# Altium schematic sheet BRD_XC95144XL.SchDoc
size A2
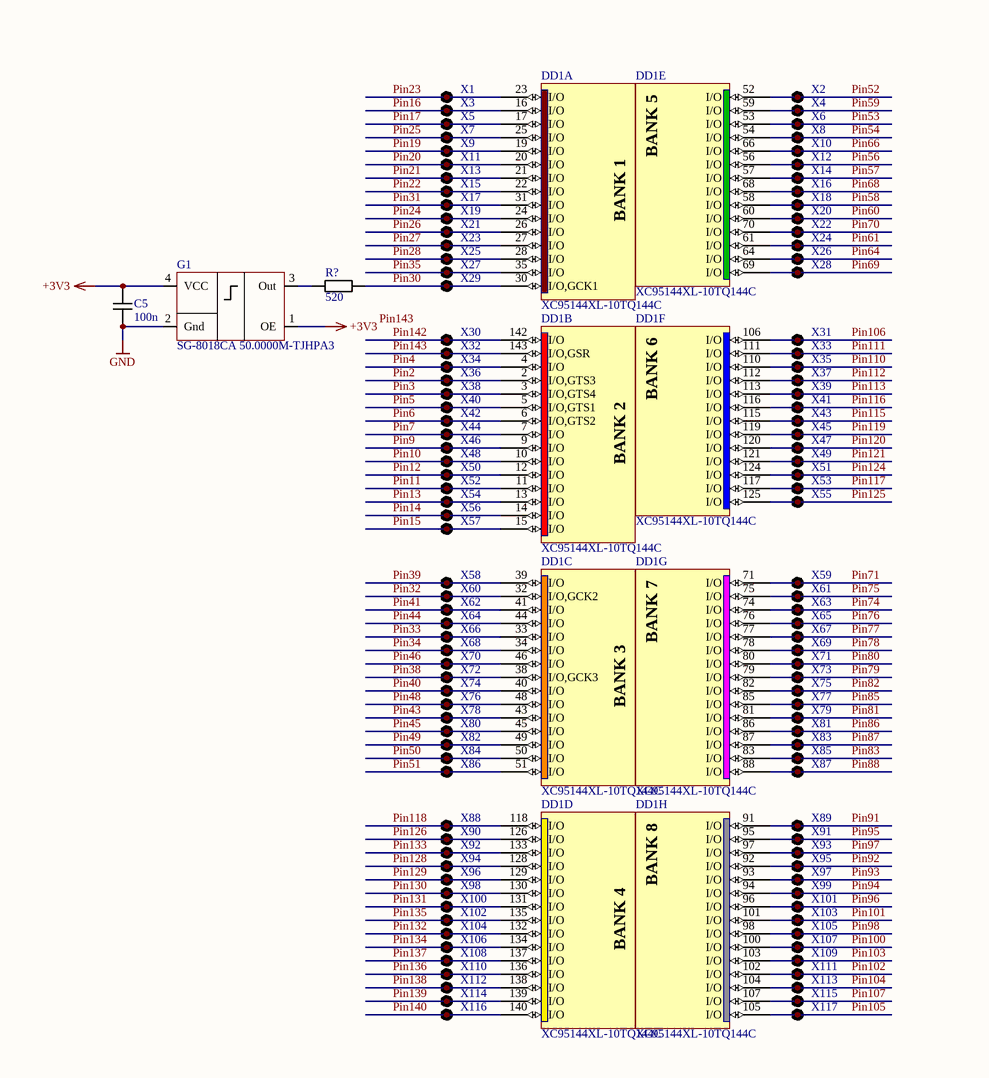
[diagram p0: BRD_XC95144XL.SchDoc, top left]
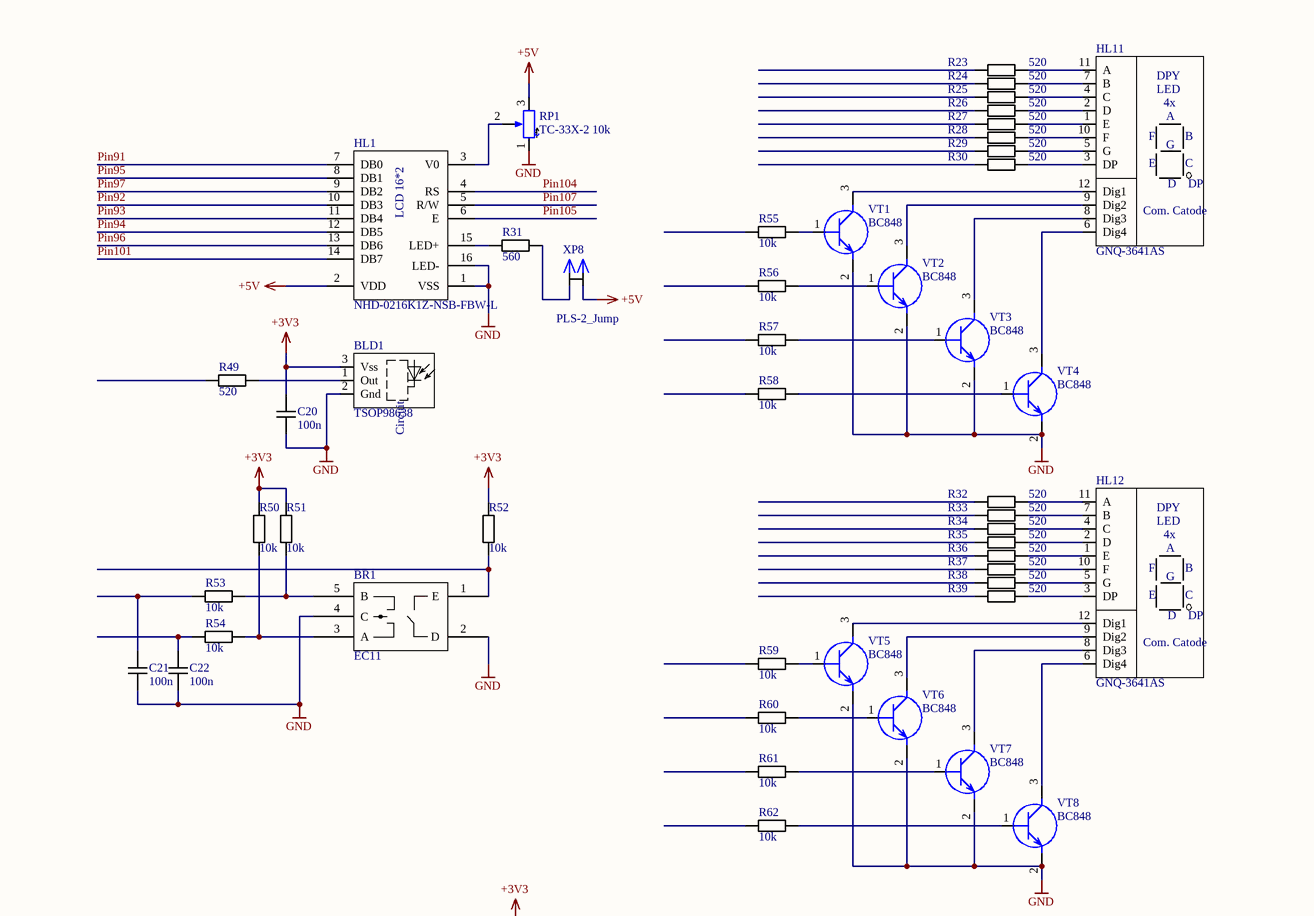
[diagram p1: BRD_XC95144XL.SchDoc, top right]
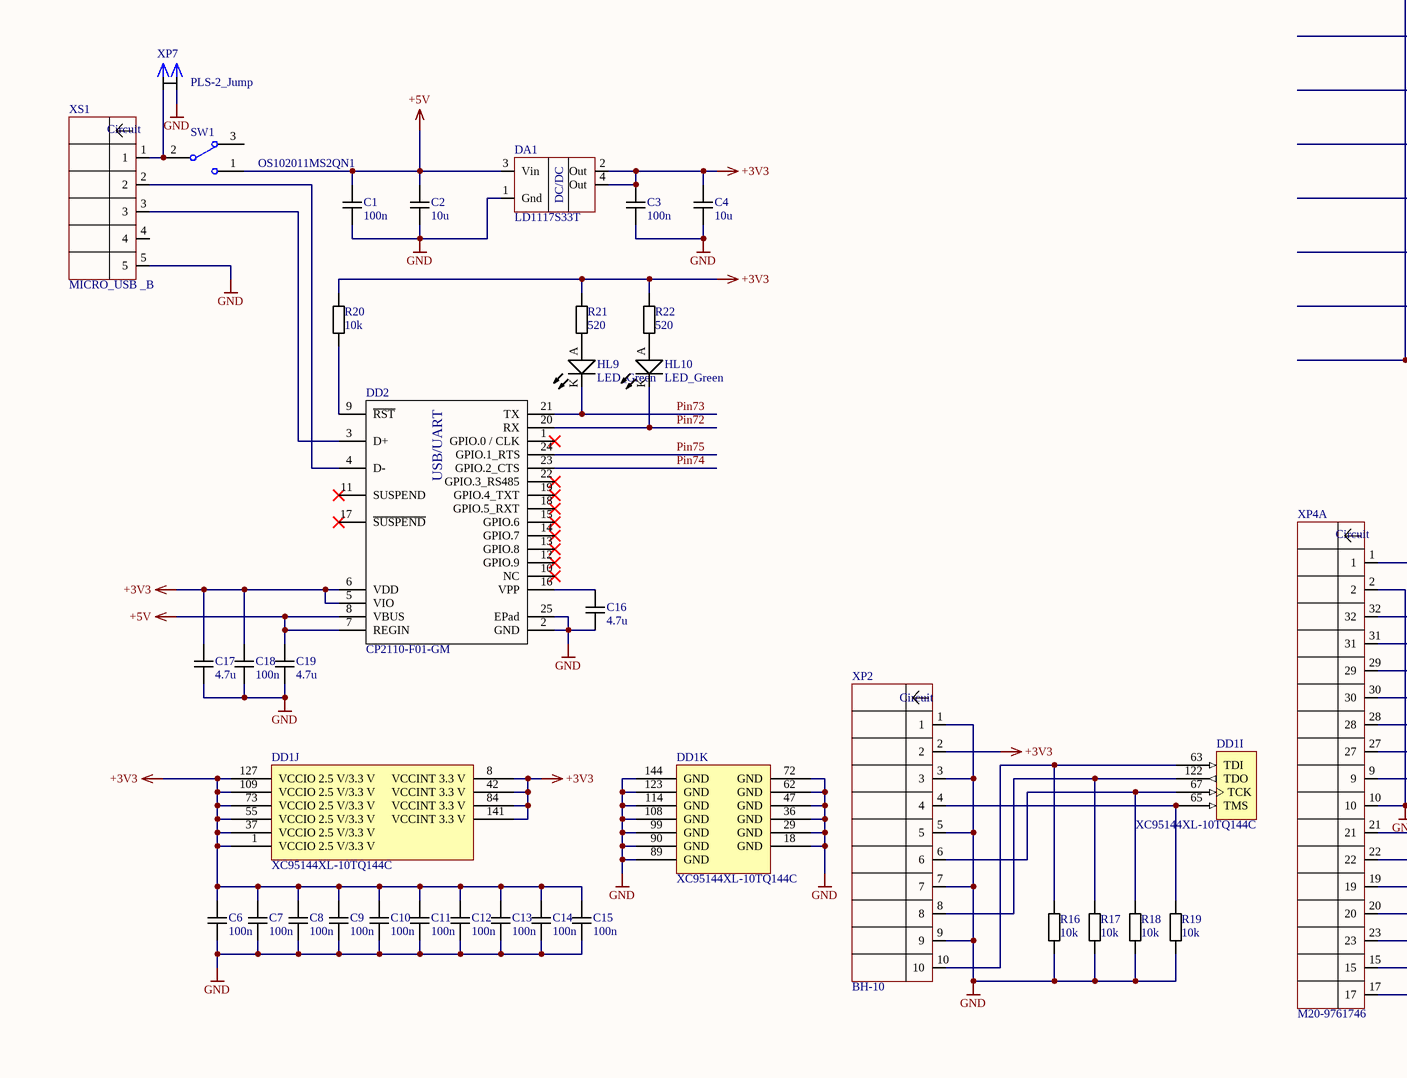
[diagram p2: BRD_XC95144XL.SchDoc, bottom left]
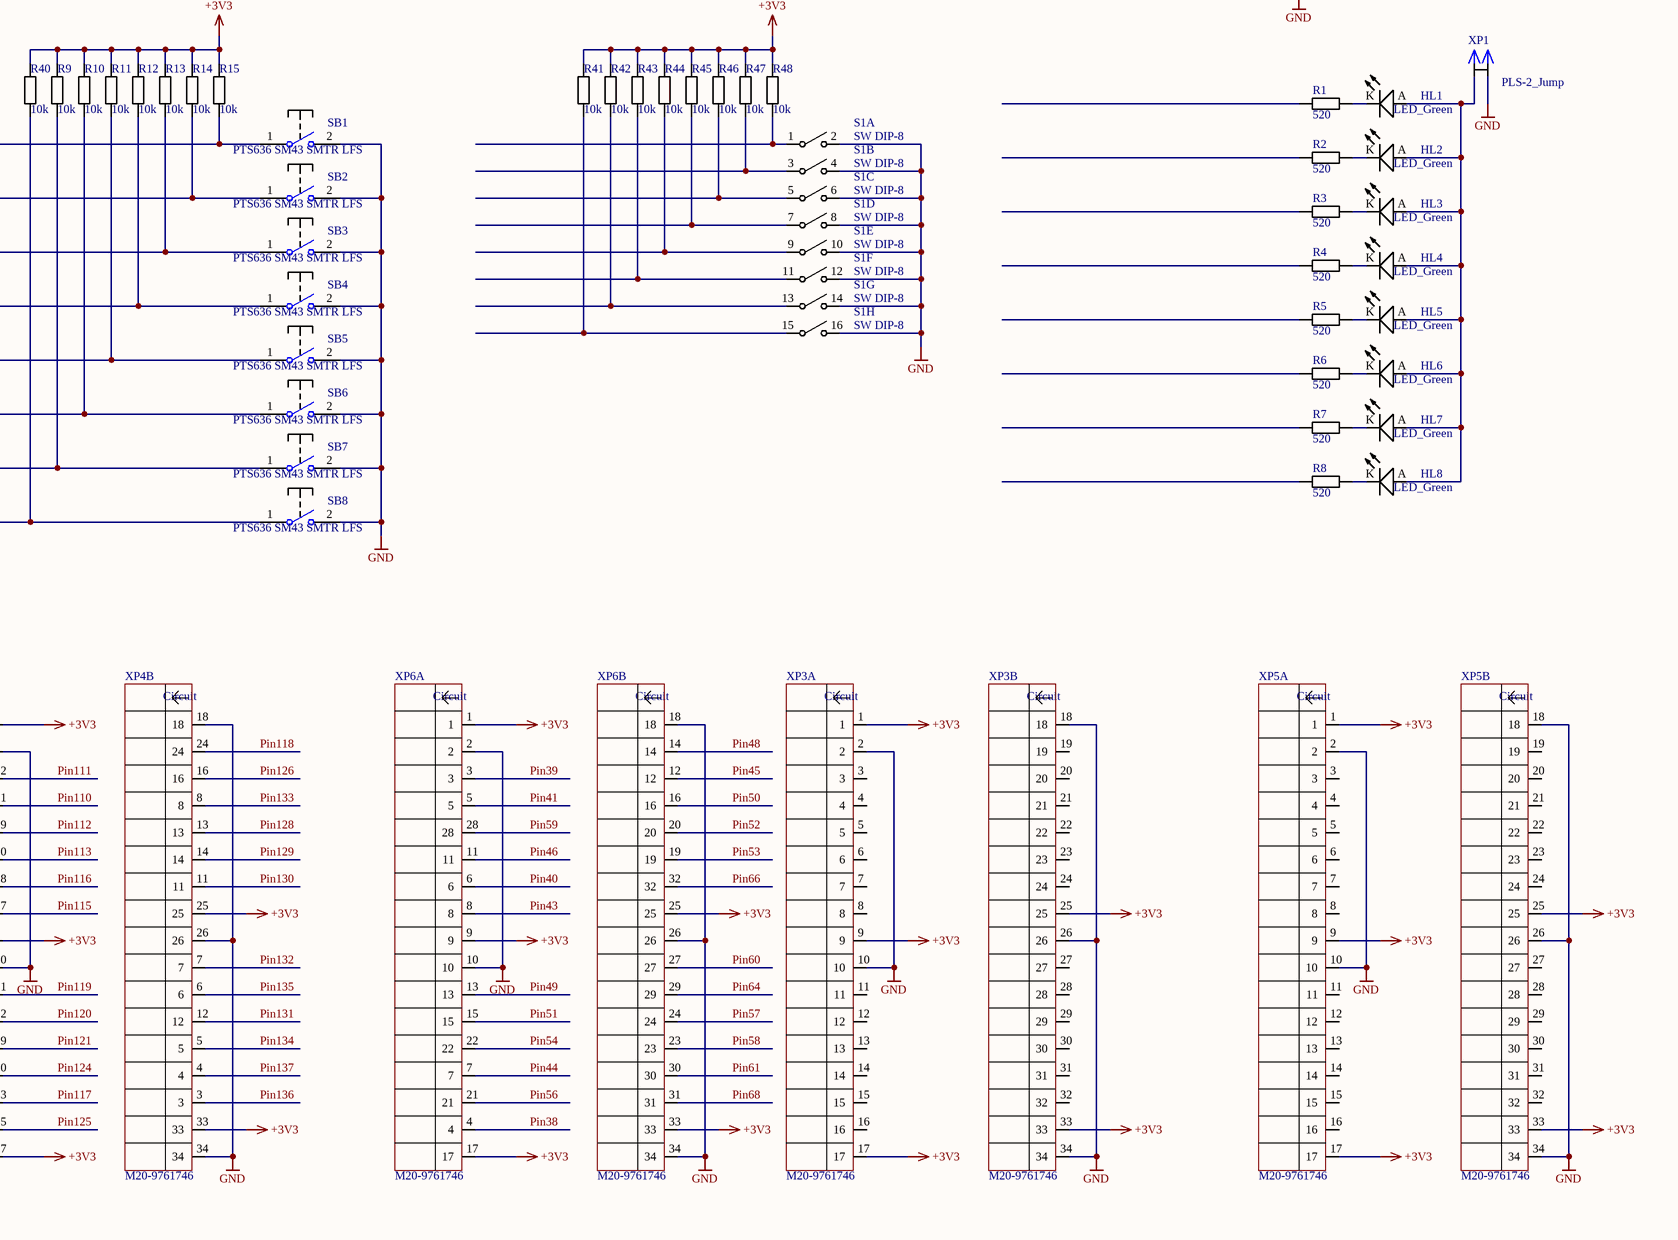
[diagram p3: BRD_XC95144XL.SchDoc, bottom right]

## Parts
(Parts that share a designator on the sheet are numbered #1, #2 ... from top to bottom, then left to right.)
BLD1  TSOP98638  [TSOP98638]
BR1  EC11  [EC11]
C1  100n  [CAPC1608(0603)N]
C2  10u  [CAPC1608(0603)N]
C3  100n  [CAPC1608(0603)N]
C4  10u  [CAPC1608(0603)N]
C5  100n  [CAPC1608(0603)N]
C6  100n  [CAPC1608(0603)N]
C7  100n  [CAPC1608(0603)N]
C8  100n  [CAPC1608(0603)N]
C9  100n  [CAPC1608(0603)N]
C10  100n  [CAPC1608(0603)N]
C11  100n  [CAPC1608(0603)N]
C12  100n  [CAPC1608(0603)N]
C13  100n  [CAPC1608(0603)N]
C14  100n  [CAPC1608(0603)N]
C15  100n  [CAPC1608(0603)N]
C16  4.7u  [CAPC1608(0603)N]
C17  4.7u  [CAPC1608(0603)N]
C18  100n  [CAPC1608(0603)N]
C19  4.7u  [CAPC1608(0603)N]
C20  100n  [CAPC1608(0603)N]
C21  100n  [CAPC1608(0603)N]
C22  100n  [CAPC1608(0603)N]
DA1  LD1117S33T  [SOT223_M]
DD1  XC95144XL-10TQ144C  [TQ144_M]  (parts A,B,C,D,E,F,G,H,I,J,K of 11)
DD2  CP2110-F01-GM  [QFN24_L]
G1  SG-8018CA 50.0000M-TJHPA3  [SG-8018CA]
HL1#1  NHD-0216K1Z-NSB-FBW-L  [NHD-0216K1Z-NSB-FBW-L]
HL1#2  LED_Green  [LED-0603-GREEN]
HL2  LED_Green  [LED-0603-GREEN]
HL3  LED_Green  [LED-0603-GREEN]
HL4  LED_Green  [LED-0603-GREEN]
HL5  LED_Green  [LED-0603-GREEN]
HL6  LED_Green  [LED-0603-GREEN]
HL7  LED_Green  [LED-0603-GREEN]
HL8  LED_Green  [LED-0603-GREEN]
HL9  LED_Green  [LED-0603-GREEN]
HL10  LED_Green  [LED-0603-GREEN]
HL11  GNQ-3641AS  [GNQ-3641AS]
HL12  GNQ-3641AS  [GNQ-3641AS]
R1  520  [RESC1608(0603)N]
R2  520  [RESC1608(0603)N]
R3  520  [RESC1608(0603)N]
R4  520  [RESC1608(0603)N]
R5  520  [RESC1608(0603)N]
R6  520  [RESC1608(0603)N]
R7  520  [RESC1608(0603)N]
R8  520  [RESC1608(0603)N]
R9  10k  [RESC1608(0603)N]
R10  10k  [RESC1608(0603)N]
R11  10k  [RESC1608(0603)N]
R12  10k  [RESC1608(0603)N]
R13  10k  [RESC1608(0603)N]
R14  10k  [RESC1608(0603)N]
R15  10k  [RESC1608(0603)N]
R16  10k  [RESC1608(0603)N]
R17  10k  [RESC1608(0603)N]
R18  10k  [RESC1608(0603)N]
R19  10k  [RESC1608(0603)N]
R20  10k  [RESC1608(0603)N]
R21  520  [RESC1608(0603)N]
R22  520  [RESC1608(0603)N]
R23  520  [RESC1608(0603)N]
R24  520  [RESC1608(0603)N]
R25  520  [RESC1608(0603)N]
R26  520  [RESC1608(0603)N]
R27  520  [RESC1608(0603)N]
R28  520  [RESC1608(0603)N]
R29  520  [RESC1608(0603)N]
R30  520  [RESC1608(0603)N]
R31  560  [RESC1608(0603)N]
R32  520  [RESC1608(0603)N]
R33  520  [RESC1608(0603)N]
R34  520  [RESC1608(0603)N]
R35  520  [RESC1608(0603)N]
R36  520  [RESC1608(0603)N]
R37  520  [RESC1608(0603)N]
R38  520  [RESC1608(0603)N]
R39  520  [RESC1608(0603)N]
R40  10k  [RESC1608(0603)N]
R41  10k  [RESC1608(0603)N]
R42  10k  [RESC1608(0603)N]
R43  10k  [RESC1608(0603)N]
R44  10k  [RESC1608(0603)N]
R45  10k  [RESC1608(0603)N]
R46  10k  [RESC1608(0603)N]
R47  10k  [RESC1608(0603)N]
R48  10k  [RESC1608(0603)N]
R49  520  [RESC1608(0603)N]
R50  10k  [RESC1608(0603)N]
R51  10k  [RESC1608(0603)N]
R52  10k  [RESC1608(0603)N]
R53  10k  [RESC1608(0603)N]
R54  10k  [RESC1608(0603)N]
R55  10k  [RESC1608(0603)N]
R56  10k  [RESC1608(0603)N]
R57  10k  [RESC1608(0603)N]
R58  10k  [RESC1608(0603)N]
R59  10k  [RESC1608(0603)N]
R60  10k  [RESC1608(0603)N]
R61  10k  [RESC1608(0603)N]
R62  10k  [RESC1608(0603)N]
R?  520  [RESC1608(0603)N]
RP1  TC-33X-2 10k  [TC-33X-2]
S1  SW DIP-8  [DS01C-254-S-08BE]  (parts A,B,C,D,E,F,G,H of 8)
SB1  PTS636 SM43 SMTR LFS  [PTS636 SM43 SMTR LFS]
SB2  PTS636 SM43 SMTR LFS  [PTS636 SM43 SMTR LFS]
SB3  PTS636 SM43 SMTR LFS  [PTS636 SM43 SMTR LFS]
SB4  PTS636 SM43 SMTR LFS  [PTS636 SM43 SMTR LFS]
SB5  PTS636 SM43 SMTR LFS  [PTS636 SM43 SMTR LFS]
SB6  PTS636 SM43 SMTR LFS  [PTS636 SM43 SMTR LFS]
SB7  PTS636 SM43 SMTR LFS  [PTS636 SM43 SMTR LFS]
SB8  PTS636 SM43 SMTR LFS  [PTS636 SM43 SMTR LFS]
SW1  OS102011MS2QN1  [OS102011MS2QN1]
VT1  BC848  [SOT23-3N]
VT2  BC848  [SOT23-3N]
VT3  BC848  [SOT23-3N]
VT4  BC848  [SOT23-3N]
VT5  BC848  [SOT23-3N]
VT6  BC848  [SOT23-3N]
VT7  BC848  [SOT23-3N]
VT8  BC848  [SOT23-3N]
X1  X1-1.27-1-TOP-RR  [1.27-1-TOP-RR]  (value not drawn)
X2  X1-1.27-1-TOP-RR  [1.27-1-TOP-RR]  (value not drawn)
X3  X1-1.27-1-TOP-RR  [1.27-1-TOP-RR]  (value not drawn)
X4  X1-1.27-1-TOP-RR  [1.27-1-TOP-RR]  (value not drawn)
X5  X1-1.27-1-TOP-RR  [1.27-1-TOP-RR]  (value not drawn)
X6  X1-1.27-1-TOP-RR  [1.27-1-TOP-RR]  (value not drawn)
X7  X1-1.27-1-TOP-RR  [1.27-1-TOP-RR]  (value not drawn)
X8  X1-1.27-1-TOP-RR  [1.27-1-TOP-RR]  (value not drawn)
X9  X1-1.27-1-TOP-RR  [1.27-1-TOP-RR]  (value not drawn)
X10  X1-1.27-1-TOP-RR  [1.27-1-TOP-RR]  (value not drawn)
X11  X1-1.27-1-TOP-RR  [1.27-1-TOP-RR]  (value not drawn)
X12  X1-1.27-1-TOP-RR  [1.27-1-TOP-RR]  (value not drawn)
X13  X1-1.27-1-TOP-RR  [1.27-1-TOP-RR]  (value not drawn)
X14  X1-1.27-1-TOP-RR  [1.27-1-TOP-RR]  (value not drawn)
X15  X1-1.27-1-TOP-RR  [1.27-1-TOP-RR]  (value not drawn)
X16  X1-1.27-1-TOP-RR  [1.27-1-TOP-RR]  (value not drawn)
X17  X1-1.27-1-TOP-RR  [1.27-1-TOP-RR]  (value not drawn)
X18  X1-1.27-1-TOP-RR  [1.27-1-TOP-RR]  (value not drawn)
X19  X1-1.27-1-TOP-RR  [1.27-1-TOP-RR]  (value not drawn)
X20  X1-1.27-1-TOP-RR  [1.27-1-TOP-RR]  (value not drawn)
X21  X1-1.27-1-TOP-RR  [1.27-1-TOP-RR]  (value not drawn)
X22  X1-1.27-1-TOP-RR  [1.27-1-TOP-RR]  (value not drawn)
X23  X1-1.27-1-TOP-RR  [1.27-1-TOP-RR]  (value not drawn)
X24  X1-1.27-1-TOP-RR  [1.27-1-TOP-RR]  (value not drawn)
X25  X1-1.27-1-TOP-RR  [1.27-1-TOP-RR]  (value not drawn)
X26  X1-1.27-1-TOP-RR  [1.27-1-TOP-RR]  (value not drawn)
X27  X1-1.27-1-TOP-RR  [1.27-1-TOP-RR]  (value not drawn)
X28  X1-1.27-1-TOP-RR  [1.27-1-TOP-RR]  (value not drawn)
X29  X1-1.27-1-TOP-RR  [1.27-1-TOP-RR]  (value not drawn)
X30  X1-1.27-1-TOP-RR  [1.27-1-TOP-RR]  (value not drawn)
X31  X1-1.27-1-TOP-RR  [1.27-1-TOP-RR]  (value not drawn)
X32  X1-1.27-1-TOP-RR  [1.27-1-TOP-RR]  (value not drawn)
X33  X1-1.27-1-TOP-RR  [1.27-1-TOP-RR]  (value not drawn)
X34  X1-1.27-1-TOP-RR  [1.27-1-TOP-RR]  (value not drawn)
X35  X1-1.27-1-TOP-RR  [1.27-1-TOP-RR]  (value not drawn)
X36  X1-1.27-1-TOP-RR  [1.27-1-TOP-RR]  (value not drawn)
X37  X1-1.27-1-TOP-RR  [1.27-1-TOP-RR]  (value not drawn)
X38  X1-1.27-1-TOP-RR  [1.27-1-TOP-RR]  (value not drawn)
X39  X1-1.27-1-TOP-RR  [1.27-1-TOP-RR]  (value not drawn)
X40  X1-1.27-1-TOP-RR  [1.27-1-TOP-RR]  (value not drawn)
X41  X1-1.27-1-TOP-RR  [1.27-1-TOP-RR]  (value not drawn)
X42  X1-1.27-1-TOP-RR  [1.27-1-TOP-RR]  (value not drawn)
X43  X1-1.27-1-TOP-RR  [1.27-1-TOP-RR]  (value not drawn)
X44  X1-1.27-1-TOP-RR  [1.27-1-TOP-RR]  (value not drawn)
X45  X1-1.27-1-TOP-RR  [1.27-1-TOP-RR]  (value not drawn)
X46  X1-1.27-1-TOP-RR  [1.27-1-TOP-RR]  (value not drawn)
X47  X1-1.27-1-TOP-RR  [1.27-1-TOP-RR]  (value not drawn)
X48  X1-1.27-1-TOP-RR  [1.27-1-TOP-RR]  (value not drawn)
X49  X1-1.27-1-TOP-RR  [1.27-1-TOP-RR]  (value not drawn)
X50  X1-1.27-1-TOP-RR  [1.27-1-TOP-RR]  (value not drawn)
X51  X1-1.27-1-TOP-RR  [1.27-1-TOP-RR]  (value not drawn)
X52  X1-1.27-1-TOP-RR  [1.27-1-TOP-RR]  (value not drawn)
X53  X1-1.27-1-TOP-RR  [1.27-1-TOP-RR]  (value not drawn)
X54  X1-1.27-1-TOP-RR  [1.27-1-TOP-RR]  (value not drawn)
X55  X1-1.27-1-TOP-RR  [1.27-1-TOP-RR]  (value not drawn)
X56  X1-1.27-1-TOP-RR  [1.27-1-TOP-RR]  (value not drawn)
X57  X1-1.27-1-TOP-RR  [1.27-1-TOP-RR]  (value not drawn)
X58  X1-1.27-1-TOP-RR  [1.27-1-TOP-RR]  (value not drawn)
X59  X1-1.27-1-TOP-RR  [1.27-1-TOP-RR]  (value not drawn)
X60  X1-1.27-1-TOP-RR  [1.27-1-TOP-RR]  (value not drawn)
X61  X1-1.27-1-TOP-RR  [1.27-1-TOP-RR]  (value not drawn)
X62  X1-1.27-1-TOP-RR  [1.27-1-TOP-RR]  (value not drawn)
X63  X1-1.27-1-TOP-RR  [1.27-1-TOP-RR]  (value not drawn)
X64  X1-1.27-1-TOP-RR  [1.27-1-TOP-RR]  (value not drawn)
X65  X1-1.27-1-TOP-RR  [1.27-1-TOP-RR]  (value not drawn)
X66  X1-1.27-1-TOP-RR  [1.27-1-TOP-RR]  (value not drawn)
X67  X1-1.27-1-TOP-RR  [1.27-1-TOP-RR]  (value not drawn)
X68  X1-1.27-1-TOP-RR  [1.27-1-TOP-RR]  (value not drawn)
X69  X1-1.27-1-TOP-RR  [1.27-1-TOP-RR]  (value not drawn)
X70  X1-1.27-1-TOP-RR  [1.27-1-TOP-RR]  (value not drawn)
X71  X1-1.27-1-TOP-RR  [1.27-1-TOP-RR]  (value not drawn)
X72  X1-1.27-1-TOP-RR  [1.27-1-TOP-RR]  (value not drawn)
X73  X1-1.27-1-TOP-RR  [1.27-1-TOP-RR]  (value not drawn)
X74  X1-1.27-1-TOP-RR  [1.27-1-TOP-RR]  (value not drawn)
X75  X1-1.27-1-TOP-RR  [1.27-1-TOP-RR]  (value not drawn)
X76  X1-1.27-1-TOP-RR  [1.27-1-TOP-RR]  (value not drawn)
X77  X1-1.27-1-TOP-RR  [1.27-1-TOP-RR]  (value not drawn)
X78  X1-1.27-1-TOP-RR  [1.27-1-TOP-RR]  (value not drawn)
X79  X1-1.27-1-TOP-RR  [1.27-1-TOP-RR]  (value not drawn)
X80  X1-1.27-1-TOP-RR  [1.27-1-TOP-RR]  (value not drawn)
X81  X1-1.27-1-TOP-RR  [1.27-1-TOP-RR]  (value not drawn)
X82  X1-1.27-1-TOP-RR  [1.27-1-TOP-RR]  (value not drawn)
X83  X1-1.27-1-TOP-RR  [1.27-1-TOP-RR]  (value not drawn)
X84  X1-1.27-1-TOP-RR  [1.27-1-TOP-RR]  (value not drawn)
X85  X1-1.27-1-TOP-RR  [1.27-1-TOP-RR]  (value not drawn)
X86  X1-1.27-1-TOP-RR  [1.27-1-TOP-RR]  (value not drawn)
X87  X1-1.27-1-TOP-RR  [1.27-1-TOP-RR]  (value not drawn)
X88  X1-1.27-1-TOP-RR  [1.27-1-TOP-RR]  (value not drawn)
X89  X1-1.27-1-TOP-RR  [1.27-1-TOP-RR]  (value not drawn)
X90  X1-1.27-1-TOP-RR  [1.27-1-TOP-RR]  (value not drawn)
X91  X1-1.27-1-TOP-RR  [1.27-1-TOP-RR]  (value not drawn)
X92  X1-1.27-1-TOP-RR  [1.27-1-TOP-RR]  (value not drawn)
X93  X1-1.27-1-TOP-RR  [1.27-1-TOP-RR]  (value not drawn)
X94  X1-1.27-1-TOP-RR  [1.27-1-TOP-RR]  (value not drawn)
X95  X1-1.27-1-TOP-RR  [1.27-1-TOP-RR]  (value not drawn)
X96  X1-1.27-1-TOP-RR  [1.27-1-TOP-RR]  (value not drawn)
X97  X1-1.27-1-TOP-RR  [1.27-1-TOP-RR]  (value not drawn)
X98  X1-1.27-1-TOP-RR  [1.27-1-TOP-RR]  (value not drawn)
X99  X1-1.27-1-TOP-RR  [1.27-1-TOP-RR]  (value not drawn)
X100  X1-1.27-1-TOP-RR  [1.27-1-TOP-RR]  (value not drawn)
X101  X1-1.27-1-TOP-RR  [1.27-1-TOP-RR]  (value not drawn)
X102  X1-1.27-1-TOP-RR  [1.27-1-TOP-RR]  (value not drawn)
X103  X1-1.27-1-TOP-RR  [1.27-1-TOP-RR]  (value not drawn)
X104  X1-1.27-1-TOP-RR  [1.27-1-TOP-RR]  (value not drawn)
X105  X1-1.27-1-TOP-RR  [1.27-1-TOP-RR]  (value not drawn)
X106  X1-1.27-1-TOP-RR  [1.27-1-TOP-RR]  (value not drawn)
X107  X1-1.27-1-TOP-RR  [1.27-1-TOP-RR]  (value not drawn)
X108  X1-1.27-1-TOP-RR  [1.27-1-TOP-RR]  (value not drawn)
X109  X1-1.27-1-TOP-RR  [1.27-1-TOP-RR]  (value not drawn)
X110  X1-1.27-1-TOP-RR  [1.27-1-TOP-RR]  (value not drawn)
X111  X1-1.27-1-TOP-RR  [1.27-1-TOP-RR]  (value not drawn)
X112  X1-1.27-1-TOP-RR  [1.27-1-TOP-RR]  (value not drawn)
X113  X1-1.27-1-TOP-RR  [1.27-1-TOP-RR]  (value not drawn)
X114  X1-1.27-1-TOP-RR  [1.27-1-TOP-RR]  (value not drawn)
X115  X1-1.27-1-TOP-RR  [1.27-1-TOP-RR]  (value not drawn)
X116  X1-1.27-1-TOP-RR  [1.27-1-TOP-RR]  (value not drawn)
X117  X1-1.27-1-TOP-RR  [1.27-1-TOP-RR]  (value not drawn)
XP1  PLS-2_Jump  [PLS-2-3D]
XP2  BH-10  [BH-10]
XP3  M20-9761746  [PLD-34-3D]  (parts A,B of 2)
XP4  M20-9761746  [PLD-34-3D]  (parts A,B of 2)
XP5  M20-9761746  [PLD-34-3D]  (parts A,B of 2)
XP6  M20-9761746  [PLD-34-3D]  (parts A,B of 2)
XP7  PLS-2_Jump  [PLS-2-3D]
XP8  PLS-2_Jump  [PLS-2-3D]
XS1  MICRO_USB _B  [MICRO_USB _B]

## Nets
+3V3: BLD1.3(Vss) C3.2 C4.2 C5.2 C6.2 C7.2 C8.2 C9.2 C10.2 C11.2 C12.2 C13.2 C14.2 C15.2 C17.2 C18.2 C20.2 DA1.2(Out) DA1.4(Out) DD1.1(VCCIO_2.5_V/3.3_V) DD1.8(VCCINT_3.3_V) DD1.37(VCCIO_2.5_V/3.3_V) DD1.42(VCCINT_3.3_V) DD1.55(VCCIO_2.5_V/3.3_V) DD1.73(VCCIO_2.5_V/3.3_V) DD1.84(VCCINT_3.3_V) DD1.109(VCCIO_2.5_V/3.3_V) DD1.127(VCCIO_2.5_V/3.3_V) DD1.141(VCCINT_3.3_V) DD2.5(VIO) DD2.6(VDD) G1.1(OE) G1.4(VCC) R9.1 R10.1 R11.1 R12.1 R13.1 R14.1 R15.1 R20.2 R21.2 R22.2 R40.1 R41.1 R42.1 R43.1 R44.1 R45.1 R46.1 R47.1 R48.1 R50.1 R51.1 R52.1 XP2.2 XP3.1 XP3.9 XP3.17 XP3.25 XP3.33 XP4.1 XP4.9 XP4.17 XP4.25 XP4.33 XP5.1 XP5.9 XP5.17 XP5.25 XP5.33 XP6.1 XP6.9 XP6.17 XP6.25 XP6.33
+5V: C1.2 C2.2 C19.2 DA1.3(Vin) DD2.7(REGIN) DD2.8(VBUS) HL1#1.2(VDD) RP1.3(TAP) SW1.1 XP8.2
GND: BLD1.2(Gnd) BR1.2(D) BR1.4(C) C1.1 C2.1 C3.1 C4.1 C5.1 C6.1 C7.1 C8.1 C9.1 C10.1 C11.1 C12.1 C13.1 C14.1 C15.1 C16.1 C17.1 C18.1 C19.1 C20.1 C21.1 C22.1 DA1.1(Gnd) DD1.18(GND) DD1.29(GND) DD1.36(GND) DD1.47(GND) DD1.62(GND) DD1.72(GND) DD1.89(GND) DD1.90(GND) DD1.99(GND) DD1.108(GND) DD1.114(GND) DD1.123(GND) DD1.144(GND) DD2.2(GND) DD2.25(EPad) G1.2(Gnd) HL1#1.1(VSS) HL1#1.16(LED-) R16.1 R17.1 R18.1 R19.1 RP1.1(TOP) S1.2 S1.4 S1.6 S1.8 S1.10 S1.12 S1.14 S1.16 SB1.2(NO) SB2.2(NO) SB3.2(NO) SB4.2(NO) SB5.2(NO) SB6.2(NO) SB7.2(NO) SB8.2(NO) VT1.2(E) VT2.2(E) VT3.2(E) VT4.2(E) VT5.2(E) VT6.2(E) VT7.2(E) VT8.2(E) XP1.2 XP2.1 XP2.3 XP2.5 XP2.7 XP2.9 XP3.2 XP3.10 XP3.18 XP3.26 XP3.34 XP4.2 XP4.10 XP4.18 XP4.26 XP4.34 XP5.2 XP5.10 XP5.18 XP5.26 XP5.34 XP6.2 XP6.10 XP6.18 XP6.26 XP6.34 XP7.2 XS1.5
Pin2: DD1.2(I/O,GTS3) X36.1
Pin3: DD1.3(I/O,GTS4) X38.1
Pin4: DD1.4(I/O) X34.1
Pin5: DD1.5(I/O,GTS1) X40.1
Pin6: DD1.6(I/O,GTS2) X42.1
Pin7: DD1.7(I/O) X44.1
Pin9: DD1.9(I/O) X46.1
Pin10: DD1.10(I/O) X48.1
Pin11: DD1.11(I/O) X52.1
Pin12: DD1.12(I/O) X50.1
Pin13: DD1.13(I/O) X54.1
Pin14: DD1.14(I/O) X56.1
Pin15: DD1.15(I/O) X57.1
Pin16: DD1.16(I/O) X3.1
Pin17: DD1.17(I/O) X5.1
Pin19: DD1.19(I/O) X9.1
Pin20: DD1.20(I/O) X11.1
Pin21: DD1.21(I/O) X13.1
Pin22: DD1.22(I/O) X15.1
Pin23: DD1.23(I/O) X1.1
Pin24: DD1.24(I/O) X19.1
Pin25: DD1.25(I/O) X7.1
Pin26: DD1.26(I/O) X21.1
Pin27: DD1.27(I/O) X23.1
Pin28: DD1.28(I/O) X25.1
Pin30: DD1.30(I/O,GCK1) R?.1 X29.1
Pin31: DD1.31(I/O) X17.1
Pin32: DD1.32(I/O,GCK2) X60.1
Pin33: DD1.33(I/O) X66.1
Pin34: DD1.34(I/O) X68.1
Pin35: DD1.35(I/O) X27.1
Pin38: DD1.38(I/O,GCK3) X72.1 XP6.4
Pin39: DD1.39(I/O) X58.1 XP6.3
Pin40: DD1.40(I/O) X74.1 XP6.6
Pin41: DD1.41(I/O) X62.1 XP6.5
Pin43: DD1.43(I/O) X78.1 XP6.8
Pin44: DD1.44(I/O) X64.1 XP6.7
Pin45: DD1.45(I/O) X80.1 XP6.12
Pin46: DD1.46(I/O) X70.1 XP6.11
Pin48: DD1.48(I/O) X76.1 XP6.14
Pin49: DD1.49(I/O) X82.1 XP6.13
Pin50: DD1.50(I/O) X84.1 XP6.16
Pin51: DD1.51(I/O) X86.1 XP6.15
Pin52: DD1.52(I/O) X2.1 XP6.20
Pin53: DD1.53(I/O) X6.1 XP6.19
Pin54: DD1.54(I/O) X8.1 XP6.22
Pin56: DD1.56(I/O) X12.1 XP6.21
Pin57: DD1.57(I/O) X14.1 XP6.24
Pin58: DD1.58(I/O) X18.1 XP6.23
Pin59: DD1.59(I/O) X4.1 XP6.28
Pin60: DD1.60(I/O) X20.1 XP6.27
Pin61: DD1.61(I/O) X24.1 XP6.30
Pin64: DD1.64(I/O) X26.1 XP6.29
Pin66: DD1.66(I/O) X10.1 XP6.32
Pin68: DD1.68(I/O) X16.1 XP6.31
Pin69: DD1.69(I/O) X28.1
Pin70: DD1.70(I/O) X22.1
Pin71: DD1.71(I/O) X59.1
Pin72: DD2.20(RX) HL10.K
Pin73: DD2.21(TX) HL9.K
Pin74: DD1.74(I/O) DD2.23(GPIO.2_CTS) X63.1
Pin75: DD1.75(I/O) DD2.24(GPIO.1_RTS) X61.1
Pin76: DD1.76(I/O) X65.1
Pin77: DD1.77(I/O) X67.1
Pin78: DD1.78(I/O) X69.1
Pin79: DD1.79(I/O) X73.1
Pin80: DD1.80(I/O) X71.1
Pin81: DD1.81(I/O) X79.1
Pin82: DD1.82(I/O) X75.1
Pin83: DD1.83(I/O) X85.1
Pin85: DD1.85(I/O) X77.1
Pin86: DD1.86(I/O) X81.1
Pin87: DD1.87(I/O) X83.1
Pin88: DD1.88(I/O) X87.1
Pin91: DD1.91(I/O) HL1#1.7(DB0) X89.1
Pin92: DD1.92(I/O) HL1#1.10(DB3) X95.1
Pin93: DD1.93(I/O) HL1#1.11(DB4) X97.1
Pin94: DD1.94(I/O) HL1#1.12(DB5) X99.1
Pin95: DD1.95(I/O) HL1#1.8(DB1) X91.1
Pin96: DD1.96(I/O) HL1#1.13(DB6) X101.1
Pin97: DD1.97(I/O) HL1#1.9(DB2) X93.1
Pin98: DD1.98(I/O) X105.1
Pin100: DD1.100(I/O) X107.1
Pin101: DD1.101(I/O) HL1#1.14(DB7) X103.1
Pin102: DD1.102(I/O) X111.1
Pin103: DD1.103(I/O) X109.1
Pin104: DD1.104(I/O) HL1#1.4(RS) X113.1
Pin105: DD1.105(I/O) HL1#1.6(E) X117.1
Pin106: DD1.106(I/O) X31.1
Pin107: DD1.107(I/O) HL1#1.5(R/W) X115.1
Pin110: DD1.110(I/O) X35.1 XP4.31
Pin111: DD1.111(I/O) X33.1 XP4.32
Pin112: DD1.112(I/O) X37.1 XP4.29
Pin113: DD1.113(I/O) X39.1 XP4.30
Pin115: DD1.115(I/O) X43.1 XP4.27
Pin116: DD1.116(I/O) X41.1 XP4.28
Pin117: DD1.117(I/O) X53.1 XP4.23
Pin118: DD1.118(I/O) X88.1 XP4.24
Pin119: DD1.119(I/O) X45.1 XP4.21
Pin120: DD1.120(I/O) X47.1 XP4.22
Pin121: DD1.121(I/O) X49.1 XP4.19
Pin124: DD1.124(I/O) X51.1 XP4.20
Pin125: DD1.125(I/O) X55.1 XP4.15
Pin126: DD1.126(I/O) X90.1 XP4.16
Pin128: DD1.128(I/O) X94.1 XP4.13
Pin129: DD1.129(I/O) X96.1 XP4.14
Pin130: DD1.130(I/O) X98.1 XP4.11
Pin131: DD1.131(I/O) X100.1 XP4.12
Pin132: DD1.132(I/O) X104.1 XP4.7
Pin133: DD1.133(I/O) X92.1 XP4.8
Pin134: DD1.134(I/O) X106.1 XP4.5
Pin135: DD1.135(I/O) X102.1 XP4.6
Pin136: DD1.136(I/O) X110.1 XP4.3
Pin137: DD1.137(I/O) X108.1 XP4.4
Pin138: DD1.138(I/O) X112.1
Pin139: DD1.139(I/O) X114.1
Pin140: DD1.140(I/O) X116.1
Pin142: DD1.142(I/O) X30.1
Pin143: DD1.143(I/O,GSR) X32.1
NetBLD1_1: BLD1.1(Out) R49.1
NetBR1_1: BR1.1(E) R52.2
NetBR1_3: BR1.3(A) R50.2 R54.2
NetBR1_5: BR1.5(B) R51.2 R53.2
NetC16_2: C16.2 DD2.16(VPP)
NetC21_2: C21.2 R53.1
NetC22_2: C22.2 R54.1
NetDD1_63: DD1.63(TDI) R16.2 XP2.10
NetDD1_65: DD1.65(TMS) R19.2 XP2.4
NetDD1_67: DD1.67(TCK) R18.2 XP2.6
NetDD1_122: DD1.122(TDO) R17.2 XP2.8
NetDD2_3: DD2.3(D+) XS1.3
NetDD2_4: DD2.4(D-) XS1.2
NetDD2_9: DD2.9(~{RST}) R20.1
NetG1_3: G1.3(Out) R?.2
NetHL1#1_3: HL1#1.3(V0) RP1.2(BOT)
NetHL1#1_15: HL1#1.15(LED+) R31.2
NetHL1#2_A: HL1#2.A HL2.A HL3.A HL4.A HL5.A HL6.A HL7.A HL8.A XP1.1
NetHL1#2_K: HL1#2.K R1.1
NetHL2_K: HL2.K R2.1
NetHL3_K: HL3.K R3.1
NetHL4_K: HL4.K R4.1
NetHL5_K: HL5.K R5.1
NetHL6_K: HL6.K R6.1
NetHL7_K: HL7.K R7.1
NetHL8_K: HL8.K R8.1
NetHL9_A: HL9.A R21.1
NetHL10_A: HL10.A R22.1
NetHL11_1: HL11.1(E) R27.1
NetHL11_2: HL11.2(D) R26.1
NetHL11_3: HL11.3(DP) R30.1
NetHL11_4: HL11.4(C) R25.1
NetHL11_5: HL11.5(G) R29.1
NetHL11_6: HL11.6(Dig4) VT4.3(C)
NetHL11_7: HL11.7(B) R24.1
NetHL11_8: HL11.8(Dig3) VT3.3(C)
NetHL11_9: HL11.9(Dig2) VT2.3(C)
NetHL11_10: HL11.10(F) R28.1
NetHL11_11: HL11.11(A) R23.1
NetHL11_12: HL11.12(Dig1) VT1.3(C)
NetHL12_1: HL12.1(E) R36.1
NetHL12_2: HL12.2(D) R35.1
NetHL12_3: HL12.3(DP) R39.1
NetHL12_4: HL12.4(C) R34.1
NetHL12_5: HL12.5(G) R38.1
NetHL12_6: HL12.6(Dig4) VT8.3(C)
NetHL12_7: HL12.7(B) R33.1
NetHL12_8: HL12.8(Dig3) VT7.3(C)
NetHL12_9: HL12.9(Dig2) VT6.3(C)
NetHL12_10: HL12.10(F) R37.1
NetHL12_11: HL12.11(A) R32.1
NetHL12_12: HL12.12(Dig1) VT5.3(C)
NetR9_2: R9.2 SB7.1(COMMON)
NetR10_2: R10.2 SB6.1(COMMON)
NetR11_2: R11.2 SB5.1(COMMON)
NetR12_2: R12.2 SB4.1(COMMON)
NetR13_2: R13.2 SB3.1(COMMON)
NetR14_2: R14.2 SB2.1(COMMON)
NetR15_2: R15.2 SB1.1(COMMON)
NetR31_1: R31.1 XP8.1
NetR40_2: R40.2 SB8.1(COMMON)
NetR41_2: R41.2 S1.15
NetR42_2: R42.2 S1.13
NetR43_2: R43.2 S1.11
NetR44_2: R44.2 S1.9
NetR45_2: R45.2 S1.7
NetR46_2: R46.2 S1.5
NetR47_2: R47.2 S1.3
NetR48_2: R48.2 S1.1
NetR55_2: R55.2 VT1.1(B)
NetR56_2: R56.2 VT2.1(B)
NetR57_2: R57.2 VT3.1(B)
NetR58_2: R58.2 VT4.1(B)
NetR59_2: R59.2 VT5.1(B)
NetR60_2: R60.2 VT6.1(B)
NetR61_2: R61.2 VT7.1(B)
NetR62_2: R62.2 VT8.1(B)
NetSW1_2: SW1.2 XP7.1 XS1.1

Not connected (* = marked no-connect by the designer): DD2 1(GPIO.0_/_CLK)* 10(NC)* 11(SUSPEND)* 12(GPIO.9)* 13(GPIO.8)* 14(GPIO.7)* 15(GPIO.6)* 17(~{SUSPEND})* 18(GPIO.5_RXT)* 19(GPIO.4_TXT)* 22(GPIO.3_RS485)*; R1 2; R2 2; R3 2; R4 2; R5 2; R6 2; R7 2; R8 2; R23 2; R24 2; R25 2; R26 2; R27 2; R28 2; R29 2; R30 2; R32 2; R33 2; R34 2; R35 2; R36 2; R37 2; R38 2; R39 2; R49 2; R55 1; R56 1; R57 1; R58 1; R59 1; R60 1; R61 1; R62 1; SW1 3; XP3 3 4 5 6 7 8 11 12 13 14 15 16 19 20 21 22 23 24 27 28 29 30 31 32; XP5 3 4 5 6 7 8 11 12 13 14 15 16 19 20 21 22 23 24 27 28 29 30 31 32; XS1 4

## Notes on the sheet
- Labels drawn without touching a wire or pin: Pin143
- (in symbol BH-10) Circuit
- (in symbol CP2110-F01-GM) USB/UART
- (in symbol GNQ-3641AS) DPY; LED; 4x; Com. Catode
- (in symbol LD1117S33T) DC/DC
- (in symbol M20-9761746, part A) Circuit
- (in symbol M20-9761746, part B) Circuit
- (in symbol MICRO_USB _B) Circuit
- (in symbol NHD-0216K1Z-NSB-FBW-L) LCD 16*2
- (in symbol TSOP98638) Circuit
- (in symbol XC95144XL-10TQ144C, part A) BANK 1
- (in symbol XC95144XL-10TQ144C, part B) BANK 2
- (in symbol XC95144XL-10TQ144C, part C) BANK 3
- (in symbol XC95144XL-10TQ144C, part D) BANK 4
- (in symbol XC95144XL-10TQ144C, part E) BANK 5
- (in symbol XC95144XL-10TQ144C, part F) BANK 6
- (in symbol XC95144XL-10TQ144C, part G) BANK 7
- (in symbol XC95144XL-10TQ144C, part H) BANK 8

## Library data of the parts
BLD1 = TSOP98638: Infrared Receivers Minicast 38kHz AGC6; Part Number: TSOP98638; HelpURL: https://eu.mouser.com/ProductDetail/Vishay-Semiconductors/TSOP98638?qs=sGAEpiMZZMvAL21a%2FDhxMux9%252B3JMN1KByARZ0rnwx0RiIZEfXUI3Hg%3D%3D; Price$: 0.34; Manufacturer Part Number: TSOP98638; MouserPart Number: 78-TSOP98638
C1-C22 = CAPC1608(0603): ?; Part Number: CAPC1608(0603); HelpURL: ?; Digi-Key Part Number: ?; Price$: ?; Note: ?; Manufacturer Part Number: ?; Package: ?
DA1 = LD1117S33T: LDO Voltage Regulators 3.3V 0.8A Positive; Part Number: LD1117S33T; HelpURL: http://www.mouser.com/ds/2/389/CD00000544-310772.pdf; Price$: ?; Digi-Key Part Number: ?; Note: ?; Manufacturer Part Number: ?; Package: ?
DD1 = XC95144XL-10TQ144C: CPLD - Complex Programmable Logic Devices 3.3V 144-mc CPLD; Published: 17-Jul-2002; LatestRevisionDate: 18-Nov-2009; LatestRevisionNote: Updated to datasheet version 2.5 May-2009.; DatasheetVersion: ver2.0, Apr-2007; PackageVersion: ver1.2, Jun-2004; PackageReference: TQ144; Publisher: Altium Limited; PackageDescription: 144-Pin Thin Quad Flat Pack (TQ144); Supplier 1: Newark; Supplier Part Number 1: 57K6676; Code_JEDEC: MS-026-BFB; ComponentLink1Description: XC95144XL Datasheet; ComponentLink1URL: http://www.xilinx.com/support/documentation/data_sheets/ds056.pdf; ComponentLink2Description: TQ144 Package Drawing; ComponentLink2URL: http://www.xilinx.com/support/documentation/package_specs/tq144.pdf; ComponentLink3Description: XC9500XL Documents; ComponentLink3URL: http://www.xilinx.com/support/documentation/xc9500xl.htm; ComponentLink4Description: Xilinx.com Home; ComponentLink4URL: http://www.xilinx.com; Part Number: XC95144XL-10TQ144C; HelpURL: https://eu.mouser.com/ProductDetail/Xilinx/XC95144XL-10TQ144C?qs=%2Fha2pyFadugTsCOhII8KNhsdGgeTmifNm2GEPSy%2F%252BVgXqq8fbWDCPCTEWIHflfdW; Manufacturer Part Number: XC95144XL-10TQ144C; Mouser Part Number: 217-95144XL-10TQ144C / XC95144XL-10TQ144C
DD2 = CP2110-F01-GM: USB Bridge, USB to UART USB 2.0 UART Interface 24-QFN (4x4); Part Number: CP2110-F01-GM; HelpURL: https://www.digikey.com/product-detail/en/silicon-labs/CP2110-F01-GM/336-2006-5-ND/2486180; Price$: 1,54; Digi-Key Part Number: 336-2006-5-ND; Manufacturer Part Number: CP2110-F01-GM; Package: 24-QFN (4x4)
G1 = SG-8018CA 50.0000M-TJHPA3: Standard Clock Oscillators XTAL OSC MHZ(O/E)3.3V 100PPM -40~85C BULK - CUT TAPE; Part Number: SG-8018CA 50.0000M-TJHPA3; HelpURL: https://eu.mouser.com/ProductDetail/Epson-Timing/SG-8018CA-500000M-TJHPA3?qs=sGAEpiMZZMtldj7qu1ydrbV2KlGvrVWIY9gBdo%252BVXqTvRWd88c1eVw%3D%3D; Price$: 0.763; Manufacturer Part Number: SG-8018CA 50.0000M-TJHPA3
HL1#1 = NHD-0216K1Z-NSB-FBW-L: LCD Character Display Modules & Accessories FSTN (-) Transm 80.0 x 36.0; Part Number: NHD-0216K1Z-NSB-FBW-L; HelpURL: https://eu.mouser.com/ProductDetail/Newhaven-Display/NHD-0216K1Z-NSB-FBW-L?qs=sGAEpiMZZMt7dcPGmvnkBq9RSAvEJGmRBxVpTR9oBwA%3D; Price$: 6,76; Manufacturer Part Number: NHD-0216K1Z-NSB-FBW-L
HL1#2 HL2-HL10 = LED-0603-GREEN: LED GREEN DIFFUSED 0603 SMD; Manufacturer Part Number: 150060VS55040; Part Number: LED-0603-GREEN; HelpURL: https://www.digikey.com/products/en?keywords=732-12017-1-ND; Digi-Key Part Number: 732-12017-1-ND; Price$: ?; Note: ?; Package: ?
R1-R62 R? = RESC1608(0603): Note: ???; Part Number: RESC1608(0603); HelpURL: ???; Digi-Key Part Number: ???; Price$: ???; Manufacturer Part Number: ???; Package: ???
RP1 = TC-33X-2: Note: ???; Part Number: TC-33X-2; HelpURL: https://www.digikey.com/product-detail/en/bourns-inc/TC33X-1-102E/TC33X-1-102E-ND/2566866; Digi-Key Part Number: ???; Price$: ???; Manufacturer Part Number: ???; Package: ???
S1 = DS01C-254-S-08BE: DIP SWITCH, SPST, 2.54 PITCH, RA; Published: 24-Mar-1999; LatestRevisionDate: 17-Jul-2002; LatestRevisionNote: Re-released for DXP Platform.; PackageReference: DIP_SW_8WAY_SMD; Publisher: Altium Limited; PackageDescription: DIP Switch; 16 Leads; Part Number: DS01C-254-S-08BE; HelpURL: https://www.digikey.com/product-detail/en/cui-devices/DS01C-254-S-08BE/2223-DS01C-254-S-08BE-ND/11310924; Digi-Key Part Number: 2223-DS01C-254-S-08BE-ND; Price$: 0.64; Manufacturer Part Number: DS01C-254-S-08BE
SB1-SB8 = PTS636 SM43 SMTR LFS: Tactile Switches Tact 50mA 12VDC, 6.0x3.5, 4.3mm H, 180gf, G leads, No ground pin, Black Actuator; Part Number: PTS636 SM43 SMTR LFS; HelpURL: https://eu.mouser.com/ProductDetail/CK/PTS636-SM43-SMTR-LFS?qs=sGAEpiMZZMsgGjVA3toVBC4OPD95ORcgaeKhIDqe9Es%3D; Price$: 0.11; Manufacturer Part Number: PTS636 SM43 SMTR LFS; Package: 2pinSMD; Mouser Part Number: 611-PTS636SM43SMTRLF
SW1 = OS102011MS2QN1: SWITCH SLIDE SPDT 100MA 12V; Note: ???; ComponentLink1Description: Manufacturer Link; ComponentLink1URL: http://www.apem.com; Part Number: OS102011MS2QN1; HelpURL: https://www.digikey.com/product-detail/en/c-k/OS102011MS2QN1/CKN9565-ND/411602; Digi-Key Part Number: CKN9565-ND; Price$: ???; Manufacturer Part Number: OS102011MS2QN1; Package: ???
VT1-VT8 = BC848: Note: ???; Part Number: BC848; HelpURL: http://www.nxp.com/documents/data_sheet/BC848_SER.pdf; Digi-Key Part Number: ???; Price$: ???; Manufacturer Part Number: ???; Package: ???
XP1 XP7 XP8 = PLS-2_Jump: CONN HEADER VERT 2POS 2.54MM; Manufacturer Part Number: PRPC002SAAN-RC; Note: ???; Part Number: PLS-2_Jump; HelpURL: https://www.digikey.com/product-detail/en/sullins-connector-solutions/PRPC002SAAN-RC/S1011EC-02-ND/2775252; Digi-Key Part Number: S1011EC-02-ND; Price$: 0.08; Package: Header 2POS 2.54mm
XP2 = BH-10: Note: ???; Part Number: BH-10; Digi-Key Part Number: -
XP3-XP6 = M20-9761746: Headers & Wire Housings 17+17 DIL VERTICAL PIN HEADER TIN; Part Number: M20-9761746; HelpURL: https://eu.mouser.com/ProductDetail/Harwin/M20-9761746?qs=sGAEpiMZZMs%252BGHln7q6pmzlZUuX%2F53qj7MeP%2FHlsHzw%3D; Price$: 0.475; Manufacturer Part Number: M20-9761746; Package: Header 34POS 2.54mm
XS1 = MICRO_USB _B: Note: ???; Part Number: MICRO_USB _B; HelpURL: https://www.digikey.com/product-detail/en/amphenol-icc-fci/10118194-0001LF/609-4618-1-ND/2785382; Digi-Key Part Number: ???; Price$: ???; Manufacturer Part Number: ???; Package: ???
BR1 = EC11: Part Number: EC11
HL11 HL12 = GNQ-3641AS: Part Number: GNQ-3641AS; HelpURL: http://malibor.by/sitedocs/07976.pdf; Digi-Key Part Number: QUAD DIGIT LED DISPLAY Comm cathide; Manufacturer Part Number: GNQ-3641AS
X1-X117 = X1-1.27-1-TOP-RR: Part Number: X1-1.27-1-TOP-RR